# Altium schematic sheet LINK_PAGE.SchDoc
size A; SheetNumber: 1; SheetTotal: 15
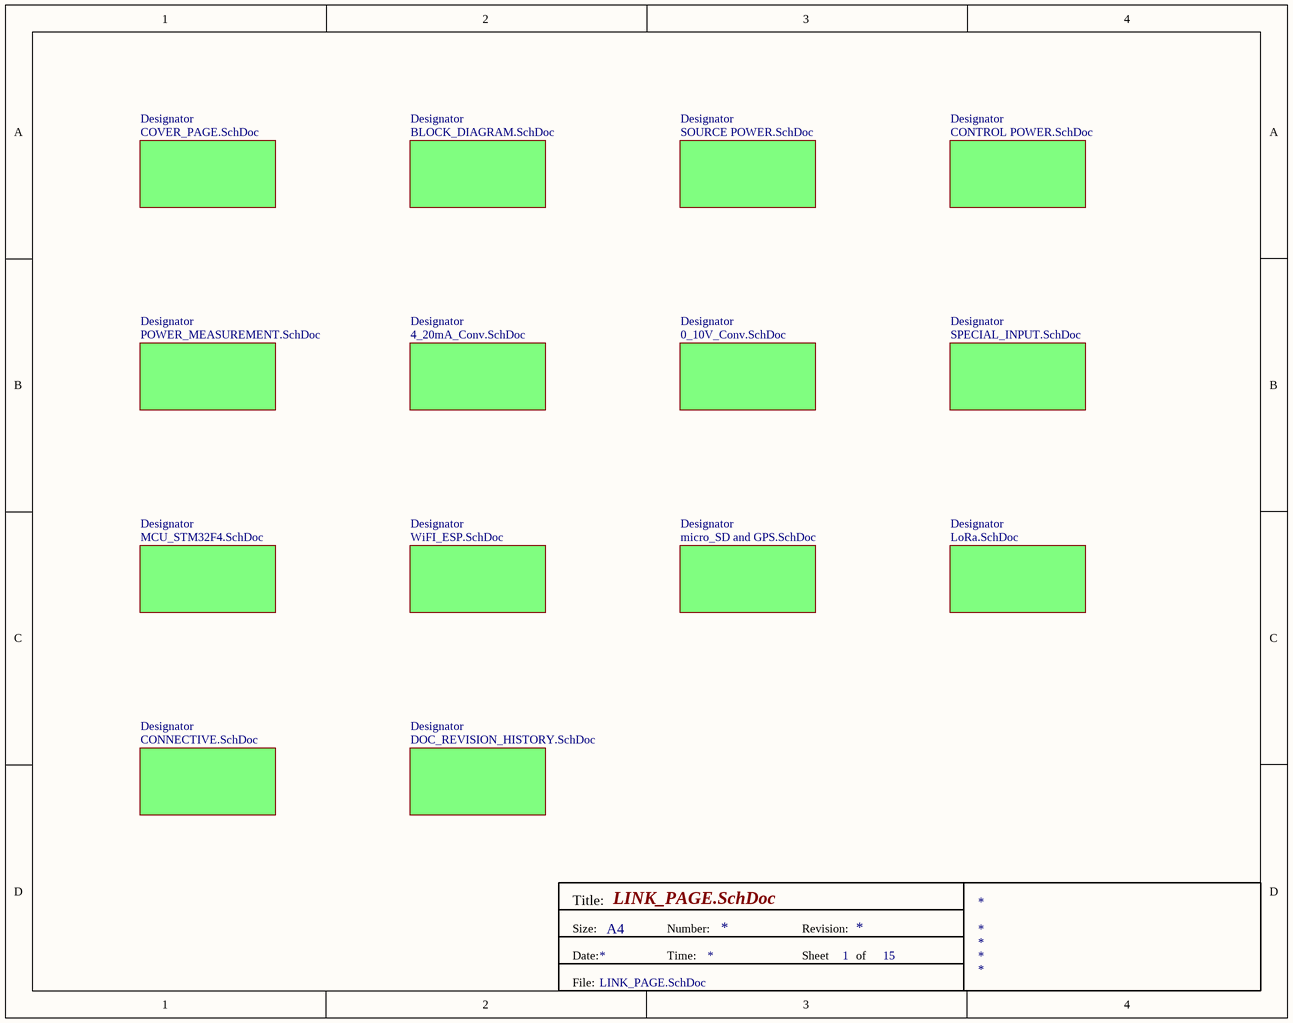
[diagram p0: LINK_PAGE.SchDoc]

## Sub-sheets
Designator = COVER_PAGE.SchDoc: no entries
Designator = BLOCK_DIAGRAM.SchDoc: no entries
Designator = SOURCE POWER.SchDoc: no entries
Designator = CONTROL POWER.SchDoc: no entries
Designator = POWER_MEASUREMENT.SchDoc: no entries
Designator = 4_20mA_Conv.SchDoc: no entries
Designator = 0_10V_Conv.SchDoc: no entries
Designator = SPECIAL_INPUT.SchDoc: no entries
Designator = MCU_STM32F4.SchDoc: no entries
Designator = WiFI_ESP.SchDoc: no entries
Designator = micro_SD and GPS.SchDoc: no entries
Designator = LoRa.SchDoc: no entries
Designator = CONNECTIVE.SchDoc: no entries
Designator = DOC_REVISION_HISTORY.SchDoc: no entries

## Notes on the sheet
- Title:
- Size:
- Date:
- A4
- Number:
- Time:
- Revision:
- Sheet
- of
- File: